# EAGLE design C128_Z80Plus (EAGLE 7.7.0)
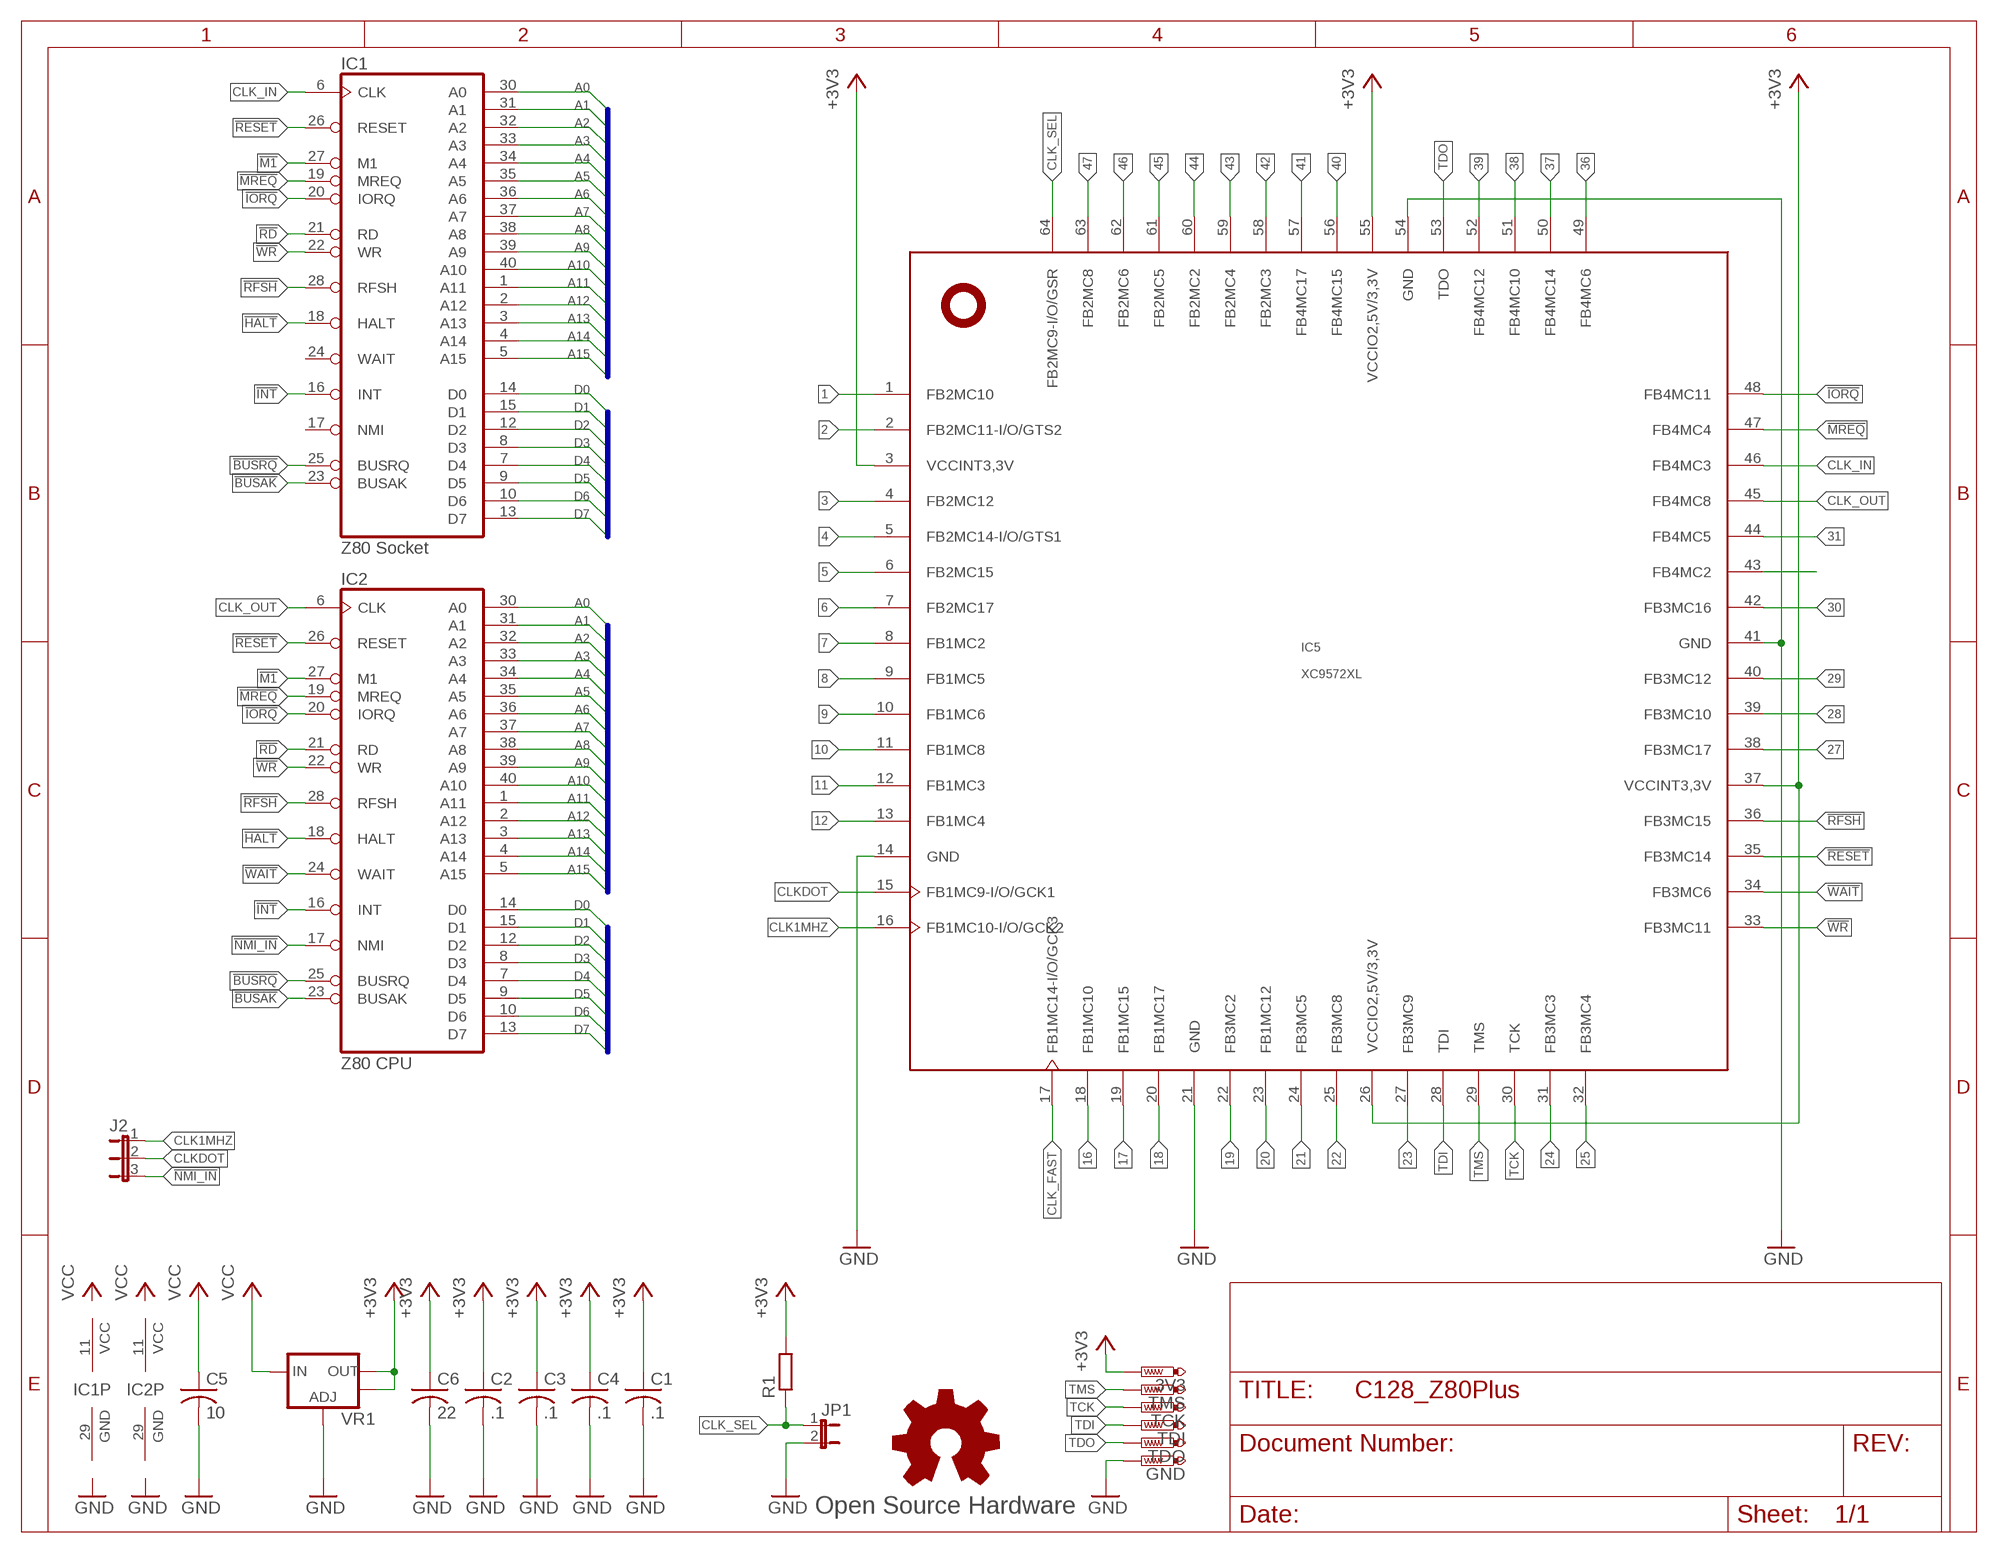
[diagram p0: schematic, sheet 1]

## Parts
3V3  PTR1TP08R  [TP08R]
C1  .1  C-USC0402  [C0402]
C2  .1  C-USC0402  [C0402]
C3  .1  C-USC0402  [C0402]
C4  .1  C-USC0402  [C0402]
C5  10  C-USC0805  [C0805]
C6  22  C-USC0805  [C0805]
GND  PTR1TP08R  [TP08R]
GOLD_ORB_SM1  Open Source Hardware  OSHWLOGOLOGO5MM  [OSHW_5MM]
IC1  Z80 Socket  Z84C00X-R  [DIL40-ROUNDPAD]
IC2  Z80 CPU  Z84C00X-R  [DIL40-ROUNDPAD]
IC5  XC9572XL  XC9572XLVQG64  [VQFP64]
J2  JP2E  [JP2]
JP1  JP1E  [JP1]
R1  R-EU_R0402  [R0402]
TCK  PTR1TP08R  [TP08R]
TDI  PTR1TP08R  [TP08R]
TDO  PTR1TP08R  [TP08R]
TMS  PTR1TP08R  [TP08R]
VR1  V_REG_LM1117SOT223  [SOT223]

## Nets
1: IC5.1(FB2MC10)
2: IC5.2(FB2MC11-I/O/GTS2)
3: IC5.4(FB2MC12)
4: IC5.5(FB2MC14-I/O/GTS1)
5: IC5.6(FB2MC15)
6: IC5.7(FB2MC17)
7: IC5.8(FB1MC2)
8: IC5.9(FB1MC5)
9: IC5.10(FB1MC6)
10: IC5.11(FB1MC8)
11: IC5.12(FB1MC3)
12: IC5.13(FB1MC4)
16: IC5.18(FB1MC10)
17: IC5.19(FB1MC15)
18: IC5.20(FB1MC17)
19: IC5.22(FB3MC2)
20: IC5.23(FB1MC12)
21: IC5.24(FB3MC5)
22: IC5.25(FB3MC8)
23: IC5.27(FB3MC9)
24: IC5.31(FB3MC3)
25: IC5.32(FB3MC4)
27: IC5.38(FB3MC17)
28: IC5.39(FB3MC10)
29: IC5.40(FB3MC12)
30: IC5.42(FB3MC16)
31: IC5.44(FB4MC5)
36: IC5.49(FB4MC6)
37: IC5.50(FB4MC14)
38: IC5.51(FB4MC10)
39: IC5.52(FB4MC12)
40: IC5.56(FB4MC15)
41: IC5.57(FB4MC17)
42: IC5.58(FB2MC3)
43: IC5.59(FB2MC4)
44: IC5.60(FB2MC2)
45: IC5.61(FB2MC5)
46: IC5.62(FB2MC6)
47: IC5.63(FB2MC8)
!BUSAK: IC1.23(BUSAK) IC2.23(BUSAK)
!BUSRQ: IC1.25(BUSRQ) IC2.25(BUSRQ)
!HALT: IC1.18(HALT) IC2.18(HALT)
!INT: IC1.16(INT) IC2.16(INT)
!IORQ: IC1.20(IORQ) IC2.20(IORQ) IC5.48(FB4MC11)
!M1: IC1.27(M1) IC2.27(M1)
!MREQ: IC1.19(MREQ) IC2.19(MREQ) IC5.47(FB4MC4)
!NMI_IN: IC2.17(NMI) J2.3
!RD: IC1.21(RD) IC2.21(RD)
!RESET: IC1.26(RESET) IC2.26(RESET) IC5.35(FB3MC14)
!RFSH: IC1.28(RFSH) IC2.28(RFSH) IC5.36(FB3MC15)
!WAIT: IC2.24(WAIT) IC5.34(FB3MC6)
!WR: IC1.22(WR) IC2.22(WR) IC5.33(FB3MC11)
+3V3: 3V3.TP C1.1 C2.1 C3.1 C4.1 C6.1 IC5.3(VCCINT3,3V) IC5.26(VCCIO2,5V/3,3V) IC5.37(VCCINT3,3V) IC5.55(VCCIO2,5V/3,3V) R1.2 VR1.2(OUT) VR1.4(OUT)
A0: IC1.30(A0) IC2.30(A0)
A1: IC1.31(A1) IC2.31(A1)
A2: IC1.32(A2) IC2.32(A2)
A3: IC1.33(A3) IC2.33(A3)
A4: IC1.34(A4) IC2.34(A4)
A5: IC1.35(A5) IC2.35(A5)
A6: IC1.36(A6) IC2.36(A6)
A7: IC1.37(A7) IC2.37(A7)
A8: IC1.38(A8) IC2.38(A8)
A9: IC1.39(A9) IC2.39(A9)
A10: IC1.40(A10) IC2.40(A10)
A11: IC1.1(A11) IC2.1(A11)
A12: IC1.2(A12) IC2.2(A12)
A13: IC1.3(A13) IC2.3(A13)
A14: IC1.4(A14) IC2.4(A14)
A15: IC1.5(A15) IC2.5(A15)
CLK1MHZ: IC5.16(FB1MC10-I/O/GCK2) J2.1
CLK_FAST: IC5.17(FB1MC14-I/O/GCK3)
CLK_IN: IC1.6(CLK) IC5.46(FB4MC3)
CLK_OUT: IC2.6(CLK) IC5.45(FB4MC8)
CLK_SEL: IC5.64(FB2MC9-I/O/GSR) JP1.1 R1.1
CLKDOT: IC5.15(FB1MC9-I/O/GCK1) J2.2
D0: IC1.14(D0) IC2.14(D0)
D1: IC1.15(D1) IC2.15(D1)
D2: IC1.12(D2) IC2.12(D2)
D3: IC1.8(D3) IC2.8(D3)
D4: IC1.7(D4) IC2.7(D4)
D5: IC1.9(D5) IC2.9(D5)
D6: IC1.10(D6) IC2.10(D6)
D7: IC1.13(D7) IC2.13(D7)
GND: C1.2 C2.2 C3.2 C4.2 C5.2 C6.2 GND.TP IC5.14(GND) IC5.21(GND) IC5.41(GND) IC5.54(GND) JP1.2 VR1.1(ADJ)
PORT4: IC5.43(FB4MC2)
TCK: IC5.30(TCK) TCK.TP
TDI: IC5.28(TDI) TDI.TP
TDO: IC5.53(TDO) TDO.TP
TMS: IC5.29(TMS) TMS.TP
VCC: C5.1 VR1.3(IN)
Unconnected: IC1.17(NMI) IC1.24(WAIT)

## Buses
A[0..15]
D[0..7]

## Power pins joined to a net without a drawn wire
GND: IC1.29(GND) IC2.29(GND)
VCC: IC1.11(VCC) IC2.11(VCC)

## Library data of the parts
3V3 GND TCK TDI TDO TMS = testpad:PTR1: TEST PIN
C1-C6 = rcl:C-US: CAPACITOR, American symbol
GOLD_ORB_SM1 = oshw:OSHWLOGO: The OSHW logo for PCB layout
IC1 IC2 = micro-zilog-jlb:Z84C00X: Z80 FAMILY DEVICE
IC5 = xilinx_xc95XXXxl:XC9572XLVQG64
J2 = jumper-jlb:JP2E: JUMPER
JP1 = jumper-jlb:JP1E: JUMPER
R1 = resistor:R-EU_: RESISTOR, European symbol
VR1 = SparkFun:V_REG_LM1117: Voltage Regulator LM1117 Standard adjustable voltage regulator but in SMD form. Spark Fun Electronics SKU : COM-00595

## Board
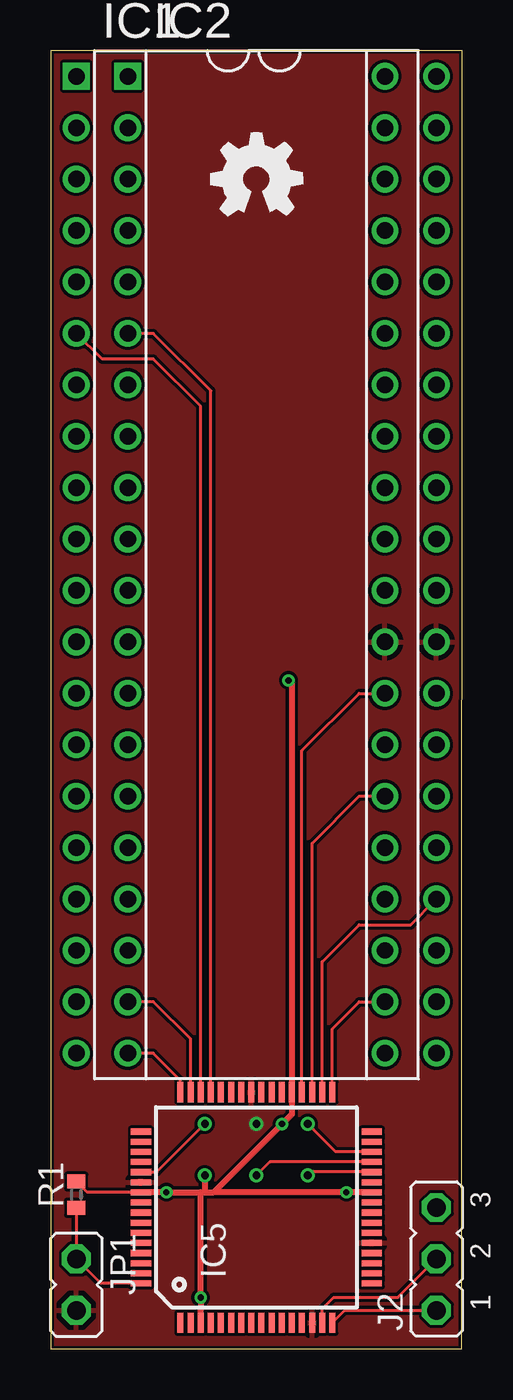
[diagram p1: board, top side]
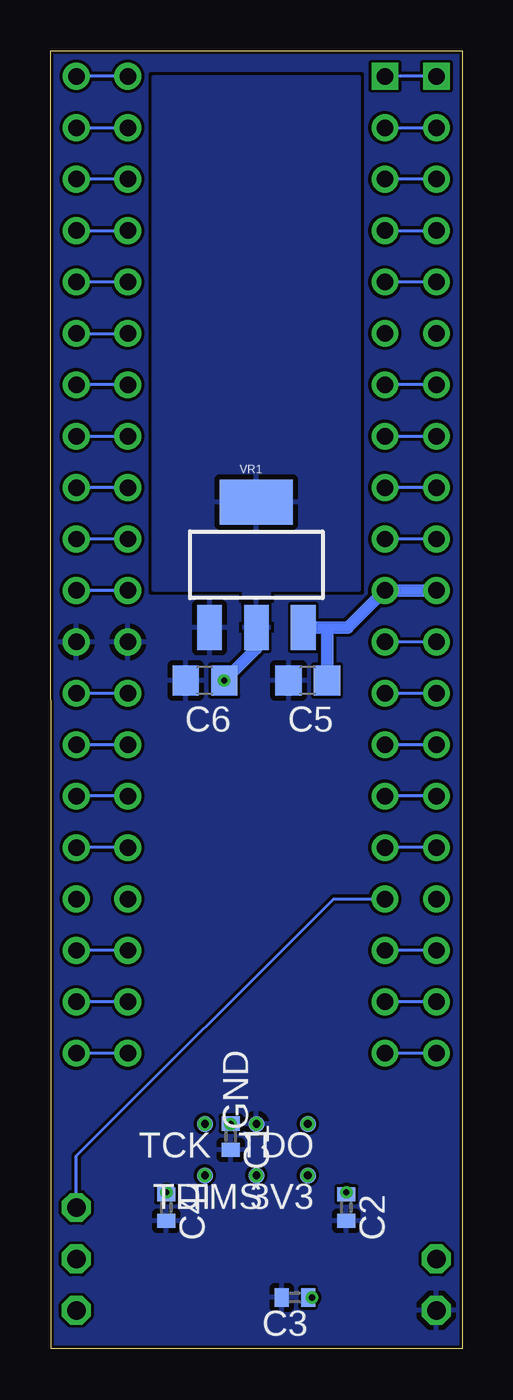
[diagram p2: board, bottom side, seen from below]

Size 20.32 x 64.13 mm. Coordinates in mm from the lower left corner, seen from the top.
Outline: 0,0 20.3,0 20.32,64.13 0,64.13 0,0
Copper layers (1*16): Top 0.035mm / dielectric 1.5mm / Bottom 0.035mm
Design rules "hackvana": minimum track width 6mil, minimum drill 0.3mm, track to track 6mil, track to pad 6mil, pad to pad 6mil, via to via 6mil, smd to smd 0mil, copper to edge 6mil, drill to drill 6mil, minimum pad ring 10mil, minimum via ring 6mil, stop-mask expansion 2mil, vias tented up to drill 100mil, thermal gap 10mil

### Footprints (pad centres in the part's own frame; a part is rotated, then mirrored left to right if it is on the bottom)
TP08R = smd 0.8 x 0.8: TP 0,0
C0402 = smd 0.7 x 0.9: 1 -0.65,0; 2 0.65,0
C0805 = smd 1.3 x 1.5: 1 -0.95,0; 2 0.95,0
DIL40-ROUNDPAD = drill 0.813 square: 1 -24.13,-7.62 | drill 0.813: 2 -21.59,-7.62; 3 -19.05,-7.62; 4 -16.51,-7.62; 5 -13.97,-7.62; 6 -11.43,-7.62; 7 -8.89,-7.62; 8 -6.35,-7.62; 9 -3.81,-7.62; 10 -1.27,-7.62; 11 1.27,-7.62; 12 3.81,-7.62; 13 6.35,-7.62; 14 8.89,-7.62; 15 11.43,-7.62; 16 13.97,-7.62; 17 16.51,-7.62; 18 19.05,-7.62; 19 21.59,-7.62; 20 24.13,-7.62; 21 24.13,7.62; 22 21.59,7.62; 23 19.05,7.62; 24 16.51,7.62; 25 13.97,7.62; 26 11.43,7.62; 27 8.89,7.62; 28 6.35,7.62; 29 3.81,7.62; 30 1.27,7.62; 31 -1.27,7.62; 32 -3.81,7.62; 33 -6.35,7.62; 34 -8.89,7.62; 35 -11.43,7.62; 36 -13.97,7.62; 37 -16.51,7.62; 38 -19.05,7.62; 39 -21.59,7.62; 40 -24.13,7.62
VQFP64 = smd 1 x 0.3: 1 -5.7,3.75; 2 -5.7,3.25; 3 -5.7,2.75; 4 -5.7,2.25; 5 -5.7,1.75; 6 -5.7,1.25; 7 -5.7,0.75; 8 -5.7,0.25; 9 -5.7,-0.25; 10 -5.7,-0.75; 11 -5.7,-1.25; 12 -5.7,-1.75; 13 -5.7,-2.25; 14 -5.7,-2.75; 15 -5.7,-3.25; 16 -5.7,-3.75; 33 5.7,-3.75; 34 5.7,-3.25; 35 5.7,-2.75; 36 5.7,-2.25; 37 5.7,-1.75; 38 5.7,-1.25; 39 5.7,-0.75; 40 5.7,-0.25; 41 5.7,0.25; 42 5.7,0.75; 43 5.7,1.25; 44 5.7,1.75; 45 5.7,2.25; 46 5.7,2.75; 47 5.7,3.25; 48 5.7,3.75 | smd 0.3 x 1: 17 -3.75,-5.7; 18 -3.25,-5.7; 19 -2.75,-5.7; 20 -2.25,-5.7; 21 -1.75,-5.7; 22 -1.25,-5.7; 23 -0.75,-5.7; 24 -0.25,-5.7; 25 0.25,-5.7; 26 0.75,-5.7; 27 1.25,-5.7; 28 1.75,-5.7; 29 2.25,-5.7; 30 2.75,-5.7; 31 3.25,-5.7; 32 3.75,-5.7; 49 3.75,5.7; 50 3.25,5.7; 51 2.75,5.7; 52 2.25,5.7; 53 1.75,5.7; 54 1.25,5.7; 55 0.75,5.7; 56 0.25,5.7; 57 -0.25,5.7; 58 -0.75,5.7; 59 -1.25,5.7; 60 -1.75,5.7; 61 -2.25,5.7; 62 -2.75,5.7; 63 -3.25,5.7; 64 -3.75,5.7
JP2 = drill 0.914 octagon: 1 -2.54,0; 2 0,0; 3 2.54,0
JP1 = drill 0.914 octagon: 1 0,-1.27; 2 0,1.27
R0402 = smd 0.7 x 0.9: 1 -0.65,0; 2 0.65,0
SOT223 = smd 1.219 x 2.235: 1 -2.311,-3.099; 2 0,-3.099; 3 2.311,-3.099 | smd 3.6 x 2.2: 4 0,3.099

### Placement (x,y rotation side)
3V3  7.62,8.57 180 bottom
C1  11.43,10.48 270 bottom
C2  5.71,6.99 270 bottom
C3  8.26,2.54 180 bottom
C4  14.61,6.99 270 bottom
C5  7.62,33.02 180 bottom
C6  12.7,33.02 180 bottom
GND  10.16,11.11 90 bottom
GOLD_ORB_SM1  10.16,57.79 0 top
IC1  8.89,38.73 270 top
IC2  11.43,38.73 270 top
IC5  10.16,6.99 90 top
J2  19.05,4.45 90 top
JP1  1.27,3.17 180 top
R1  1.27,7.62 90 top
TCK  12.7,11.11 180 bottom
TDI  12.7,8.57 180 bottom
TDO  7.62,11.11 180 bottom
TMS  10.16,8.57 180 bottom
VR1  10.16,38.73 0 bottom

### Tracks (layer width: path | path; a pad name or v marks a point on that pad's centre or on a via)
!BUSAK
  Bottom 0.152: IC1.23 IC2.23
!BUSRQ
  Bottom 0.152: IC1.25 IC2.25
!HALT
  Bottom 0.152: IC1.18 IC2.18
!INT
  Bottom 0.152: IC1.16 IC2.16
!IORQ
  Top 0.152: IC5.48 6.41,13.28 5.08,14.61 IC2.20
  Bottom 0.152: IC1.20 IC2.20
!M1
  Bottom 0.152: IC1.27 IC2.27
!MREQ
  Top 0.152: IC5.47 6.91,15.31 5.08,17.14 IC2.19
  Bottom 0.152: IC1.19 IC2.19
!NMI_IN
  Bottom 0.152: J2.3 19.05,9.53 6.35,22.22 IC2.17
!RD
  Bottom 0.152: IC1.21 IC2.21
!RESET
  Top 0.152: IC5.35 12.91,24.97 15.24,27.3 IC1.26
  Bottom 0.152: IC1.26 IC2.26
!RFSH
  Top 0.152: IC5.36 12.41,29.55 15.24,32.39 IC1.28
  Bottom 0.152: IC1.28 IC2.28
!WAIT
  Top 0.152: IC5.34 13.41,19.12 15.24,20.95 17.78,20.95 IC2.24
!WR
  Top 0.152: IC5.33 13.91,15.81 15.24,17.14 IC1.22
  Bottom 0.152: IC1.22 IC2.22
+3V3  (via drill 0.3, 0.38)
  Top 0.152: IC5.55 1.8,7.73 R1.2
  Top 0.305: 7.41,7.73 v5.71,7.73 IC5.55 | 7.62,7.73 8.05,7.73 | 8.05,7.73 v11.43,11.11 11.91,11.59 IC5.37 11.91,32.86 C6.1 | IC5.3 7.41,1.91 v7.41,2.54 7.41,7.73 | IC5.26 v14.61,7.73 8.05,7.73 | 3V3.TP 7.62,7.73 | 7.41,7.73 7.62,7.73
  Bottom 0.305: C1.1 v11.43,11.11 | C4.1 v14.61,7.73 | C2.1 v5.71,7.73 | C3.1 v7.41,2.54
  Bottom 0.61: VR1.2 10.16,34.61 C6.1
  other vias: 7.62,8.57 11.75,33.02
  pour Bottom: 5.08,37.47 9.53,37.47 9.53,34.61 10.79,34.61 10.79,37.47 15.24,37.47 15.24,62.87 5.08,62.87
A0
  Bottom 0.152: IC1.30 IC2.30
A1
  Bottom 0.152: IC1.31 IC2.31
A2
  Bottom 0.152: IC1.32 IC2.32
A3
  Bottom 0.152: IC2.33 IC1.33
A4
  Bottom 0.152: IC1.34 IC2.34
A5
  Bottom 0.152: IC2.35 IC1.35
A6
  Bottom 0.152: IC1.36 IC2.36
A7
  Bottom 0.152: IC2.37 IC1.37
A8
  Bottom 0.152: IC1.38 IC2.38
A9
  Bottom 0.152: IC2.39 IC1.39
A10
  Bottom 0.152: IC1.40 IC2.40
A11
  Bottom 0.152: IC1.1 IC2.1
A12
  Bottom 0.152: IC2.2 IC1.2
A13
  Bottom 0.152: IC1.3 IC2.3
A14
  Bottom 0.152: IC2.4 IC1.4
A15
  Bottom 0.152: IC1.5 IC2.5
CLK1MHZ
  Top 0.152: IC5.16 14.53,1.91 J2.1
CLK_IN
  Top 0.152: IC5.46 7.41,46.57 5.08,48.9 2.54,48.9 IC1.6
CLK_OUT
  Top 0.152: IC5.45 7.91,47.34 5.08,50.16 IC2.6
CLK_SEL
  Top 0.152: IC5.64 2.48,3.24 JP1.1 R1.1
CLKDOT
  Top 0.152: IC5.15 13.41,1.98 13.97,2.54 17.14,2.54 J2.2
D0
  Bottom 0.152: IC1.14 IC2.14
D1
  Bottom 0.152: IC1.15 IC2.15
D2
  Bottom 0.152: IC1.12 IC2.12
D3
  Bottom 0.152: IC2.8 IC1.8
D4
  Bottom 0.152: IC1.7 IC2.7
D5
  Bottom 0.152: IC1.9 IC2.9
D6
  Bottom 0.152: IC1.10 IC2.10
D7
  Bottom 0.152: IC1.13 IC2.13
GND  (via drill 0.38)
  other vias: 10.16,11.11
  pour Top: 0,0 20.32,0 20.32,64.13 0,64.13
  pour Bottom (rank 2): 0,0 20.32,0 20.32,64.13 0,64.13
TCK  (via drill 0.38)
  Top 0.152: IC5.30 14.08,9.73 TCK.TP
  other vias: 12.7,11.11
TDI  (via drill 0.38)
  Top 0.152: IC5.28 12.86,8.73 TDI.TP
  other vias: 12.7,8.57
TDO  (via drill 0.38)
  Top 0.152: IC5.53 5.24,8.73 TDO.TP
  other vias: 7.62,11.11
TMS  (via drill 0.38)
  Top 0.152: IC5.29 10.82,9.23 TMS.TP
  other vias: 10.16,8.57
VCC
  Bottom 0.61: IC1.11 IC2.11 5.64,35.64 6.35,35.64 6.67,35.64 | 6.67,35.64 VR1.3 | C5.1 6.67,35.64